# EasyEDA Pro project ProPrj_MBC1  FRAM（AM29F016）(定稿)_2024-09-28.epro, board PCB1
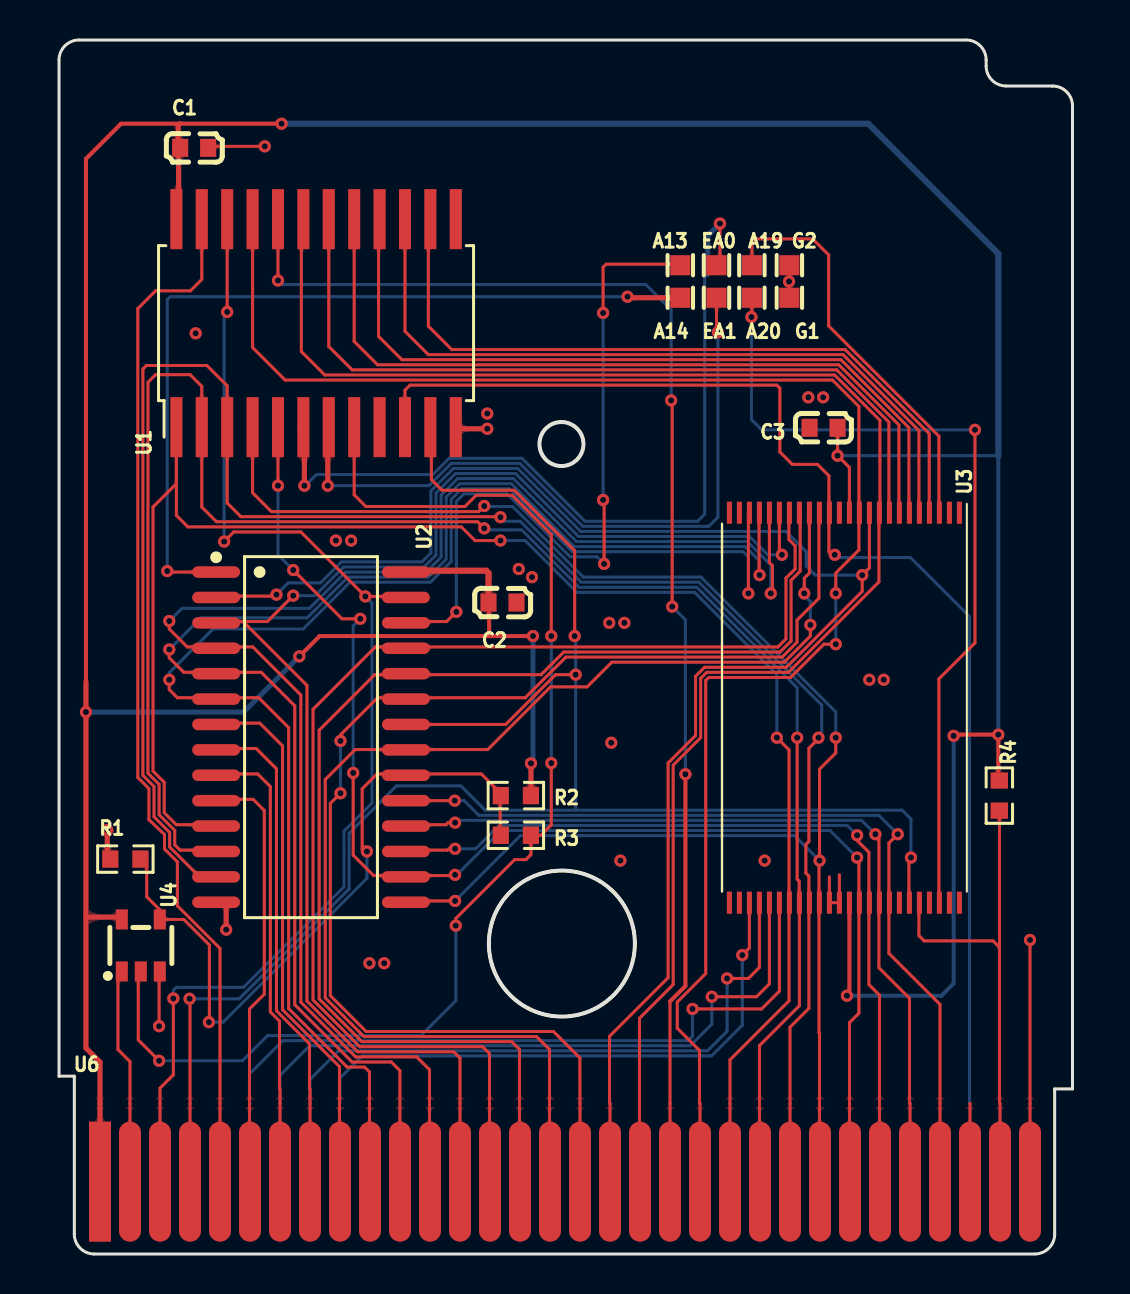
[diagram p1: board, top side]
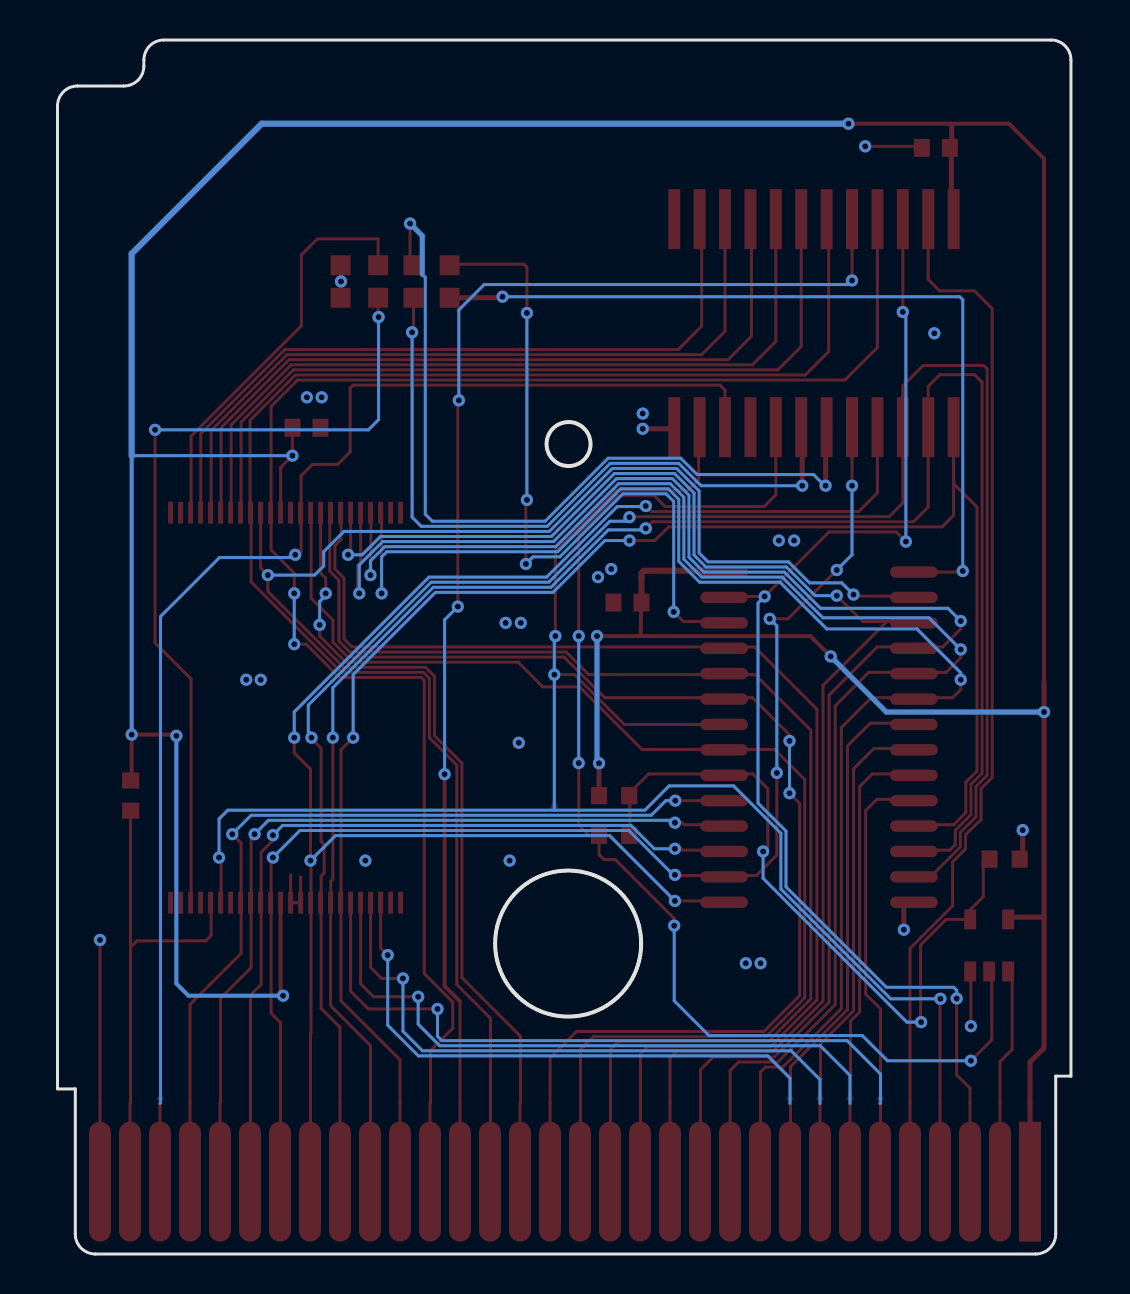
[diagram p2: board, bottom side, seen from below]

Outline 50.67 x 60.7 mm; copper layers: Top Layer, Bottom Layer. Coordinates in mm from the lower left corner of the outline.
Outline path: circle c25.12,40.5 r1.1 ; circle c25.14,15.52 r3.65 ; 0,59.7 arc(0.29,60.41) 1,60.7 45.36,60.7 arc(46.06,60.41) 46.36,59.7 46.36,59.4 arc(46.65,58.69) 47.36,58.4 49.67,58.4 arc(50.38,58.11) 50.67,57.4 50.67,8.25 49.78,8.25 49.78,1 arc(49.49,0.29) 48.78,0 1.76,0 arc(1.05,0.29) 0.76,1 0.76,8.89 0,8.89 0,59.7 ; 21.49,15.52 arc(25.14,19.17) 28.79,15.52 arc(25.14,11.87) 21.49,15.52
Stack: Top Layer 0.035mm / Dielectric1 1.51mm FR4 er 4.5 / Bottom Layer 0.035mm

## Design rules (mm)
template: JLCPCB Capability(Two Layers Board)
spacing copperThickness1oz (default): track to track 0.102, other pairs 0.152 to 0.3
spacing copperThickness2oz: track to track 0.203, other pairs 0.152 to 0.3
track width copperThickness1oz (default): min 0.127, default 0.254, max 2.54
track width copperThickness2oz: min 0.203, default 0.254, max 2.54
differential pair differentialPair (default): width min 0.127, default 0.254, max 2.54; gap min 0.152, default 0.152
via viaSize (default): diameter min 0.5, default 0.61, max 10; hole min 0.3, default 0.305, max 6.3

## Placement (name value [footprint] x y rotation side)
A13  Battery_Positive_After_Resistor  [test_1p]  31.06 49.44 0 top
A14  RTC_VOUT  [test_1p]  31.06 47.81 0 top
A19  Battery_Positive  [test_1p]  34.64 49.44 0 top
A20  Ground  [test_1p]  34.64 47.81 0 top
C1  100nF  [C0603]  6.76 55.31 180 top
C2  100nF  [C0603]  22.17 32.57 180 top
C3  100nF  [C0603]  38.23 41.31 0 top
EA0  Battery_Positive  [test_1p]  32.87 49.44 0 top
EA1  Ground  [test_1p]  32.87 47.81 0 top
G1  Ground  [test_1p]  36.52 47.81 0 top
G2  Battery_Positive  [test_1p]  36.52 49.44 0 top
R1  1kΩ  [R0603]  3.32 19.75 180 top
R2  10kΩ  [R0603]  22.84 22.92 0 top
R3  0Ω  [R0603]  22.84 20.94 0 top
R4  10kΩ  [R0603]  47.02 22.92 270 top
U1  MBC1  [MemoryBC1:SOIC-24 W_7.5x15.4mm_P1.27mm]  12.85 46.54 90 top
U2  FM1808B-SGTR  [SOIC-28_L17.9-W7.5-P1.27-LS10.3-BL]  12.6 25.84 270 top
U3  AM29F016  [Package_SO:TSOP-I-48_18.4x12mm_P0.5mm]  39.27 27.31 270 top
U4  SN74LVC1G32DBVR  [SOT-23-5_L3.0-W1.7-P0.95-LS2.8-BR]  4.09 15.43 270 top
U6  -  [gbgba cartbus]  25.3 3.62 0 top

## Footprints (pads in the part's own frame, mm; a bottom-side part is the same pattern mirrored in y, then rotated)
C0603
  rect 0.8x0.9 smd: 1(-0.7,0) 2(0.7,0)
gbgba cartbus
  rect 1.1x6 smd: 1(-23.25,0)
  oval 1.1x6 smd: 2(-21.75,0) 3(-20.25,0) 4(-18.75,0) 5(-17.25,0) 6(-15.75,0) 7(-14.25,0) 8(-12.75,0) 9(-11.25,0) 10(-9.75,0) 11(-8.25,0) 12(-6.75,0) 13(-5.25,0) 14(-3.75,0) 15(-2.25,0) 16(-0.75,0) 17(0.75,0) 18(2.25,0) 19(3.75,0) 20(5.25,0) 21(6.75,0) 22(8.25,0) 23(9.75,0) 24(11.25,0) 25(12.75,0) 26(14.25,0) 27(15.75,0) 28(17.25,0) 29(18.75,0) 30(20.25,0) 31(21.75,0) 32(23.25,0)
MemoryBC1:SOIC-24 W_7.5x15.4mm_P1.27mm
  rect 3x0.6 smd: 1(-5.2,6.985) 2(-5.2,5.715) 3(-5.2,4.445) 4(-5.2,3.175) 5(-5.2,1.905) 6(-5.2,0.635) 7(-5.2,-0.635) 8(-5.2,-1.905) 9(-5.2,-3.175) 10(-5.2,-4.445) 11(-5.2,-5.715) 12(-5.2,-6.985) 13(5.2,-6.985) 14(5.2,-5.715) 15(5.2,-4.445) 16(5.2,-3.175) 17(5.2,-1.905) 18(5.2,-0.635) 19(5.2,0.635) 20(5.2,1.905) 21(5.2,3.175) 22(5.2,4.445) 23(5.2,5.715) 24(5.2,6.985)
Package_SO:TSOP-I-48_18.4x12mm_P0.5mm
  rect 1.1x0.25 smd: 1(-9.75,5.75) 2(-9.75,5.25) 3(-9.75,4.75) 4(-9.75,4.25) 5(-9.75,3.75) 6(-9.75,3.25) 7(-9.75,2.75) 8(-9.75,2.25) 9(-9.75,1.75) 10(-9.75,1.25) 11(-9.75,0.75) 12(-9.75,0.25) 13(-9.75,-0.25) 14(-9.75,-0.75) 15(-9.75,-1.25) 16(-9.75,-1.75) 17(-9.75,-2.25) 18(-9.75,-2.75) 19(-9.75,-3.25) 20(-9.75,-3.75) 21(-9.75,-4.25) 22(-9.75,-4.75) 23(-9.75,-5.25) 24(-9.75,-5.75) 25(9.75,-5.75) 26(9.75,-5.25) 27(9.75,-4.75) 28(9.75,-4.25) 29(9.75,-3.75) 30(9.75,-3.25) 31(9.75,-2.75) 32(9.75,-2.25) 33(9.75,-1.75) 34(9.75,-1.25) 35(9.75,-0.75) 36(9.75,-0.25) 37(9.75,0.25) 38(9.75,0.75) 39(9.75,1.25) 40(9.75,1.75) 41(9.75,2.25) 42(9.75,2.75) 43(9.75,3.25) 44(9.75,3.75) 45(9.75,4.25) 46(9.75,4.75) 47(9.75,5.25) 48(9.75,5.75)
R0603
  rect 0.806x0.864 smd: 1(-0.753,0) 2(0.753,0)
SOIC-28_L17.9-W7.5-P1.27-LS10.3-BL
  oval 0.574x2.388 smd: 1(-8.255,-4.744) 2(-6.985,-4.744) 3(-5.715,-4.744) 4(-4.445,-4.744) 5(-3.175,-4.744) 6(-1.905,-4.744) 7(-0.635,-4.744) 8(0.635,-4.744) 9(1.905,-4.744) 10(3.175,-4.744) 11(4.445,-4.744) 12(5.715,-4.744) 13(6.985,-4.744) 14(8.255,-4.744) 15(8.255,4.744) 16(6.985,4.744) 17(5.715,4.744) 18(4.445,4.744) 19(3.175,4.744) 20(1.905,4.744) 21(0.635,4.744) 22(-0.635,4.744) 23(-1.905,4.744) 24(-3.175,4.744) 25(-4.445,4.744) 26(-5.715,4.744) 27(-6.985,4.744) 28(-8.255,4.744)
SOT-23-5_L3.0-W1.7-P0.95-LS2.8-BR
  rect 1x0.6 smd: 1(1.3,-0.95) 2(1.3,0) 3(1.3,0.95) 4(-1.3,0.95) 5(-1.3,-0.95)
test_1p
  rect 1x1 smd: 1(0,0)

## Nets
As in the schematic.

Pads without a net: U1 9 13; U3 1 2 13 23 24 25 26 42 45 47 48

## Via types
v1: diameter 0.61, hole 0.305, Top Layer to Bottom Layer, 106 vias

## Routing (per net, layer and track width the routed paths; a pad name or vN(x,y) marks a point on that pad's centre or on a via; arc(x,y) is an arc through that point)
5V: length 210.7
  Top Layer w0.152: U3.12 39.52,39.33 v1(38.93,39.92) C3.2
  Top Layer w0.2: 21.51,30.9 13.03,30.9 v1(12.01,29.88) ; 21.51,30.9 v1(23.7,30.9) ; 21.51,30.9 21.47,33.82 ; 46.96,23.72 v1(46.96,25.97) 44.79,25.97 v1(44.73,25.91) ; v1(11.12,56.52) 3.1,56.52 1.35,54.76 1.35,28.61 ; U3.37 39.52,13.04 v1(39.39,12.91)
  Top Layer w0.254: 1.35,28.61 v1(1.35,27.1) 1.35,16.84 ; 1.35,16.84 1.35,10.3 2.05,9.59 U6.1 ; 1.35,16.84 3.02,16.84 U4.5 ; 6.03,56.52 5.96,56.44 5.96,55.06 ; v1(23.6,24.54) 23.6,23.1 ; 5.98,55.04 5.98,52.05
  Top Layer w0.305: 17.6,34.16 21.36,34.16 21.47,34.05 C2.2
  Bottom Layer w0.152: 46.96,39.9 46.95,39.92 v1(38.93,39.92)
  Bottom Layer w0.2: v1(44.73,25.91) 44.73,13.52 44.12,12.91 v1(39.39,12.91) ; 46.96,25.96 46.96,39.9
  Bottom Layer w0.254: v1(12.01,29.88) 9.23,27.1 v1(1.35,27.1) ; v1(23.7,30.9) 23.7,24.64 v1(23.6,24.54)
  Bottom Layer w0.305: 46.96,39.9 46.96,50.01 40.46,56.52 v1(11.12,56.52)
GND: length 28.5
  Top Layer w0.152: U4.3 5,14.09 v1(5,11.39) ; v1(48.55,15.7) U6.32 ; G1.1 G2.1 ; v1(10.29,55.38) 7.53,55.38 C1.1 ; 38.52,18.86 U3.35 U3.36 39.02,18.96
  Top Layer w0.254: v1(21.41,41.26) 20.11,41.26 19.84,41.54 ; 2.56,19.75 2.41,19.9 v1(2.41,21.19) ; 7.02,17.65 8.36,17.65 v1(8.36,16.22)
  vias: v1(6.83,46.03) v1(13.84,35.67) v1(14.6,35.67) v1(15.52,14.54) v1(16.26,14.54) v1(21.41,42.02) v1(22.99,34.25) v1(23.65,33.84) v1(27.51,31.56) v1(27.61,25.56) v1(28.07,19.67) v1(28.27,31.56) v1(35.28,19.67) v1(36.5,48.63) v1(37.46,42.83) v1(38.2,42.83) v1(40.51,28.71) v1(41.24,28.71)
A0: length 56
  Top Layer w0.152: U6.6 9.52,3.64 9.52,12.25 10.26,12.99 10.26,22.17 9.7,22.73 8.3,22.73 ; v1(31.67,12.25) 35.13,12.25 36.02,13.14 U3.30
  Bottom Layer w0.152: 9.55,7.53 9.52,7.55 9.52,9 11.19,10.67 31.46,10.67 31.67,10.88 v1(31.67,12.25)
A1: length 55.1
  Top Layer w0.152: 8.3,24 9.93,24 10.57,23.37 10.57,12.1 11.02,11.65 11.02,8.27 11.05,8.24 U6.7 ; v1(32.64,12.86) 34.87,12.86 35.52,13.51 U3.29
  Bottom Layer w0.152: 11.05,7.53 11.05,8.93 12.53,10.41 31.56,10.41 32.64,11.49 v1(32.64,12.86)
A2: length 55.1
  Top Layer w0.152: U3.28 35.02,14.33 34.47,13.78 v1(33.4,13.78) ; U6.8 12.55,8.24 12.52,8.27 12.52,10.51 10.87,12.16 10.87,24.26 9.86,25.27 8.3,25.27
  Bottom Layer w0.152: 12.55,7.53 12.55,8.72 13.98,10.16 32.42,10.16 33.4,11.14 v1(33.4,13.78)
A3: length 55.1
  Top Layer w0.152: U6.9 14.02,3.64 14.02,9.37 11.18,12.21 11.18,25.4 10.04,26.54 8.3,26.54 ; v1(34.16,14.95) 34.52,15.3 U3.27
  Bottom Layer w0.152: v1(34.16,14.95) 34.16,11.44 32.63,9.91 15.16,9.91 14.05,8.79 14.05,7.53
A4: length 74.3
  Top Layer w0.152: v1(34.47,33.03) 34.47,37.01 U3.22 ; v1(5.51,28.71) 5.51,28.22 5.92,27.81 9.98,27.81 11.48,26.32 11.48,12.27 14.4,9.35 15.28,9.35 15.52,9.1 15.52,3.64 U6.10
  Bottom Layer w0.152: v1(34.47,33.03) 34.47,34.85 34.21,35.11 25.66,35.11 22.51,38.26 20.14,38.26 19.61,37.73 19.61,34.63 18.57,33.59 14.54,33.59 12.21,31.25 7.7,31.25 5.51,29.06 5.51,28.83
A5: length 75.1
  Top Layer w0.152: v1(35.03,33.94) 35,33.97 35,37.15 ; U6.11 17.04,3.62 17.04,9.17 16.61,9.6 14.65,9.6 11.79,12.47 11.79,27.41 10.11,29.08 6.24,29.08 5.51,29.81 5.51,30.23
  Bottom Layer w0.152: 5.51,30.23 7.1,31.81 12.41,31.81 14.44,33.84 18.46,33.84 19.36,34.74 19.36,37.84 20.03,38.52 22.62,38.52 25.77,35.37 34.31,35.37 35.03,34.65 v1(35.03,33.94)
  vias: v1(5.51,30.23)
A6: length 79.3
  Top Layer w0.152: U3.20 35.52,34.57 35.67,34.42 35.67,33.11 v1(35.58,33.03) ; 5.51,31.65 5.51,31.25 6.41,30.35 9.69,30.35 12.09,27.95 12.09,12.59 14.83,9.85 17.88,9.85 18.52,9.21 18.52,3.64 U6.12
  Bottom Layer w0.152: v1(35.58,33.03) 35.58,34.45 34.42,35.62 25.87,35.62 22.72,38.77 19.93,38.77 19.1,37.94 19.1,34.84 18.36,34.1 14.33,34.1 12.52,32.28 6.15,32.28 5.51,31.65
  vias: v1(5.51,31.65)
A7: length 71.3
  Top Layer w0.152: v1(36.14,34.96) 36.02,35.09 U3.19 ; v1(11.71,32.92) 10.41,31.62 9.2,31.62 ; 9.2,31.62 8.9,31.62 ; 9.2,31.62 12.39,28.43 12.39,12.65 14.93,10.11 19.74,10.11 20.05,9.8 U6.13
  Bottom Layer w0.152: v1(36.14,34.96) 35.44,34.96 34.52,35.88 25.98,35.88 22.83,39.02 19.82,39.02 18.85,38.05 18.85,34.95 18.25,34.35 14.23,34.35 12.79,32.92 v1(11.71,32.92)
A8: length 62.7
  Top Layer w0.152: U6.14 21.52,3.64 21.52,10.02 21.18,10.36 15.04,10.36 12.7,12.7 12.7,27.24 15.82,30.35 35.95,30.35 36.35,30.75 36.35,33.79 36.8,34.25 36.8,35.41 36.49,35.72 36.49,37.15
A9: length 63.3
  Top Layer w0.152: U6.15 23.02,3.64 23.02,10.23 22.63,10.62 15.14,10.62 13,12.76 13,26.19 15.78,28.97 24.1,28.97 25.24,30.1 36.05,30.1 36.6,30.65 36.6,33.69 37.06,34.14 37.06,37.09 36.99,37.15
A10: length 63.4
  Top Layer w0.152: v1(37.57,31.46) 37.57,30.9 36.26,29.59 27.64,29.59 26.41,28.36 24.57,28.36 21.44,25.22 14.81,25.22 13.31,23.72 13.31,12.81 15.25,10.87 23.88,10.87 24.52,10.22 24.52,3.64 U6.16 ; 37.26,32.93 37.26,33.79 37.52,34.05 U3.16
  Bottom Layer w0.152: 37.26,32.93 37.57,32.62 v1(37.57,31.46)
  vias: v1(37.26,33.03)
A11: length 65
  Top Layer w0.152: 37.99,37.15 37.99,32.79 36.9,31.69 36.9,30.59 36.16,29.84 25.34,29.84 23.31,27.81 15.93,27.81 14.07,25.96 v1(14.07,25.65) ; U6.17 26.06,3.62 26.05,7.53 26.04,9.81 24.72,11.12 15.35,11.12 13.56,12.92 13.56,22.53 v1(14.07,23.04)
  Bottom Layer w0.152: v1(14.07,25.65) v1(14.07,23.04)
A12: length 80.2
  Top Layer w0.152: U3.10 40.52,34.31 v1(40.16,33.94) 40.16,33.13 36.37,29.34 32.28,29.34 31.83,28.89 31.83,25.92 30.45,24.55 30.45,13.82 27.52,10.89 27.52,7.55 27.55,7.53 U6.18 ; v1(10.87,32.97) 10.8,32.89 8.3,32.89
  Bottom Layer w0.152: v1(40.16,33.94) 37.82,33.94 37.36,34.4 37.36,35.11 36.35,36.13 26.08,36.13 22.93,39.28 19.72,39.28 18.59,38.15 18.59,35.05 18.15,34.61 14.12,34.61 13.07,33.56 11.46,33.56 v1(10.87,32.97)
A13: length 82.5
  Top Layer w0.152: U1.19 12.12,51.64 12.12,45.12 13.28,43.95 38.78,43.95 41.04,41.69 41.04,37.08 40.99,37.03 ; 40.99,37.03 40.99,33.6 36.47,29.08 32.38,29.08 32.08,28.78 32.08,25.82 30.71,24.45 30.71,13.47 29.02,11.79 29.02,3.64 U6.19
A14: length 67.4
  Top Layer w0.152: v1(30.66,32.37) 30.66,42.53 30.61,42.58 ; U6.20 30.55,12.63 ; U1.20 v1(10.95,48.68)
  Top Layer w0.2: v1(31.32,23.99) 31.32,13.4 30.55,12.63
  Bottom Layer w0.152: v1(30.66,32.37) 31.32,31.71 v1(31.32,23.99) ; v1(10.95,48.68) 11.15,48.47 29.34,48.47 30.61,47.2 v1(30.61,42.68)
A15: length 83.9
  Top Layer w0.152: v1(38.84,30.49) 38.24,30.49 36.58,28.83 32.49,28.83 32.33,28.68 32.33,14.02 30.91,12.6 30.91,11.29 32.02,10.18 32.02,7.55 32.05,7.53 U6.21 ; 9.68,51.94 9.68,45.32 11.3,43.7 38.67,43.7 39.99,42.38 39.99,35.2 38.84,34.05 v1(38.84,33.03)
  Bottom Layer w0.152: v1(38.84,30.49) v1(38.84,33.03)
A16: length 38.6
  Top Layer w0.152: 42.49,37.02 42.49,41.31 39.09,44.71 17.14,44.71 15.98,45.88 15.98,51.69 U1.16
A17: length 37.5
  Top Layer w0.152: 42.99,37.03 42.99,41.17 39.2,44.97 18.47,44.97 17.3,46.14 U1.15
A18: length 36.5
  Top Layer w0.152: U1.14 18.47,51.64 18.47,46.39 19.63,45.22 39.3,45.22 43.51,41.02 43.51,37.22
AU: length 24.6
  Top Layer w0.152: 47.02,15.34 47.02,7.55 47.05,7.53 U6.31 ; 47.02,15.34 47.02,22.15 ; 47.02,15.34 46.7,15.66 43.26,15.66 42.99,15.92 42.99,17.71
CE: length 35.6
  Top Layer w0.152: v1(15.39,20.13) 15.27,20.13 15.16,20.23 15.16,23.26 15.9,24 21.12,24 22.06,23.06 22.06,20.7 ; v1(7.49,11.59) 7.52,11.62 7.52,15.45 6.24,16.73 U4.4 5.04,17.21 4.38,17.86 4.38,19.69
  Bottom Layer w0.152: v1(7.49,11.59) 8.2,11.59 15.39,18.78 v1(15.39,20.13)
CLK: length 10.6
  Top Layer w0.152: 3.14,13.87 2.95,13.68 2.95,10.22 3.55,9.62 U6.2
CS: length 52.4
  Top Layer w0.152: 7.14,51.94 7.14,48.73 6.57,48.16 4.83,48.16 3.94,47.27 3.94,23.83 4.5,23.27 4.5,21.72 5.27,20.97 5.27,20.25 5.92,19.61 5.92,17.41 8.05,15.28 U6.5
D0: length 86.2
  Top Layer w0.152: 5.87,38.62 5.87,36.93 6.44,36.36 20.12,36.36 20.8,35.67 v1(22.07,35.67) ; 5.87,38.62 5.87,39.66 ; 5.87,38.62 5.87,38.52 4.7,37.35 4.7,24.14 5.26,23.59 5.26,22.07 5.86,21.46 8.3,21.46 ; 5.87,38.62 5.87,39.66 ; v1(35.89,25.82) 36.5,25.21 36.5,12.66 33.55,9.71 U6.22 ; 5.87,39.66 U1.1
  Bottom Layer w0.152: v1(35.89,25.82) 35.89,28.97 31.78,33.08 25.9,33.08 23.31,35.67 v1(22.07,35.67)
D1: length 94.5
  Top Layer w0.152: U6.23 35.02,3.64 35.02,10.42 37.02,12.42 U3.32 37.01,17.58 37.01,18.64 36.91,18.74 v1(36.91,25.82) ; 8.3,20.19 6.05,20.19 5.78,20.46 5.78,21.18 5,21.96 5,23.48 4.45,24.04 4.44,43.59 4.83,43.97 6.55,43.97 7.14,43.38 U1.2 7.14,37.35 7.87,36.61 20.93,36.61 v1(21.26,36.28)
  Bottom Layer w0.152: v1(21.26,36.28) 21.34,36.2 23.13,36.2 26,33.34 31.88,33.34 36.91,28.31 v1(36.91,25.82)
D2: length 96.8
  Top Layer w0.152: U6.24 36.55,11.34 37.49,12.28 37.49,18.89 37.34,19.05 37.34,20.47 37.49,20.63 37.49,25.29 37.97,25.77 ; v1(22.07,36.84) 22.05,36.87 9.09,36.87 8.41,37.55 U1.3 8.41,43.41 7.39,44.42 4.37,44.42 4.19,44.25 4.19,23.93 4.75,23.37 4.75,21.86 5.53,21.08 5.53,20.35 6.96,18.92 8.3,18.92
  Bottom Layer w0.152: v1(22.07,36.84) 22.28,36.64 23.06,36.64 26.11,33.59 31.99,33.59 38.13,27.45 38.13,25.77
  vias: v1(37.97,25.82)
D3: length 83.5
  Top Layer w0.152: 17.6,17.65 v1(19.8,17.65) ; v1(21.26,37.4) 20.98,37.12 10.62,37.12 9.68,38.06 9.68,41.54 ; U6.25 38.02,3.64 38.02,11.03 38,11.06 38,19.64 v1(38.02,19.67) 38.02,24.24 38.84,25.05 38.84,25.77
  Bottom Layer w0.152: v1(21.26,37.4) 21.28,37.37 22.68,37.37 26.21,33.84 32.09,33.84 38.84,27.1 v1(38.84,25.82) ; v1(38.02,19.67) 36.77,20.92 23.07,20.92 v1(19.8,17.65)
D4: length 67.5
  Top Layer w0.152: v1(15.06,31.76) 14.15,31.76 v1(11.71,34.2) ; v1(10.95,38.42) 10.95,41.54 ; U6.26 39.52,3.64 39.52,11.57 39.99,12.04 39.99,19.73 v1(39.9,19.82) ; 19.8,18.92 15.73,18.92 14.71,19.94 v1(14.71,24.05)
  Bottom Layer w0.152: v1(10.95,38.42) 10.95,34.96 v1(11.71,34.2) ; v1(14.71,24.05) 14.71,31.41 v1(15.06,31.76) ; v1(39.9,19.82) 38.55,21.17 22.1,21.17 19.85,18.92
  vias: v1(19.8,18.96)
D5: length 40.8
  Top Layer w0.152: v1(19.8,20.26) 19.49,20.26 19.42,20.19 17.6,20.19 ; U6.27 41.02,3.64 41.02,12.94 40.49,13.47 40.49,20.09 39.9,20.68 v1(39.9,20.94)
  Bottom Layer w0.152: v1(39.9,20.94) 39.41,21.43 22,21.43 20.83,20.26 v1(19.8,20.26)
D6: length 41.7
  Top Layer w0.152: v1(19.8,21.57) 19.45,21.57 19.34,21.46 17.6,21.46 ; v1(40.82,20.99) 40.99,20.81 40.99,14.31 42.52,12.78 42.52,7.55 42.55,7.53 U6.28
  Bottom Layer w0.152: v1(40.82,20.99) 40.13,21.68 19.92,21.68 v1(19.8,21.57)
D7: length 43.9
  Top Layer w0.152: U6.29 44.05,12.48 41.49,15.03 41.49,20.55 v1(41.93,20.99) ; v1(19.79,22.67) U2.19
  Bottom Layer w0.152: v1(41.93,20.99) 40.99,21.94 20.99,21.94 20.26,22.67 v1(19.79,22.67)
EA0: length 42.1
  Top Layer w0.152: EA0.1 33.05,49.61 v1(33.05,51.52)
  Top Layer w0.254: 12.06,41.38 12.27,41.18 v1(12.27,38.42)
  Bottom Layer w0.152: 32.44,48.98 32.28,48.83 32.28,36.99 31.93,36.64 26.29,36.64 23.14,39.79 19.51,39.79 18.7,38.97 12.87,38.97 12.31,38.42 v1(12.27,38.42)
  Bottom Layer w0.254: 32.44,48.98 32.44,50.91 v1(33.05,51.52)
EA1: length 35.7
  Top Layer w0.152: v1(32.94,46.09) 32.87,46.16 EA1.1
  Top Layer w0.254: v1(13.44,38.42) 13.44,41.59 13.49,41.54
  Bottom Layer w0.152: v1(13.44,38.42) 18.49,38.42 19.61,39.53 23.04,39.53 26.19,36.38 32.49,36.38 32.94,36.84 v1(32.94,46.09)
O1: length 42.3
  Top Layer w0.152: 8.37,34.1 5.46,34.1 v1(5.41,34.15)
  Top Layer w0.254: v1(28.42,47.86) 28.52,47.86 28.57,47.81 A14.1
  Bottom Layer w0.152: v1(5.41,34.15) 5.41,47.71 5.56,47.86 v1(28.42,47.86)
O2: length 35.8
  Top Layer w0.152: 17.6,31.62 19.38,31.62 v1(19.86,32.11) ; 31.01,49.49 27.35,49.49 27.2,49.34 v1(27.2,47.05) ; v1(27.2,37.7) 27.25,37.65 v1(27.25,34.5)
  Top Layer w0.254: 31.01,49.49 A13.1
  Bottom Layer w0.152: v1(19.86,32.11) 19.86,37.63 20.24,38.01 22.41,38.01 25.56,34.86 26.9,34.86 v1(27.25,34.5) ; v1(27.2,47.05) v1(27.2,37.7)
O3: length 20.7
  Top Layer w0.152: 43.99,37.03 43.99,40.89 38.48,46.4 38.48,49.95 37.68,50.75 34.64,50.75 A19.1
O4: length 41.9
  Top Layer w0.152: v1(34.62,46.85) 34.64,46.87 A20.1 ; v1(45.8,41.21) 45.8,30.56 43.99,28.75 43.99,17.59
  Bottom Layer w0.152: v1(45.8,41.21) 35.13,41.21 34.62,41.72 v1(34.62,46.85)
RA14: length 40.5
  Top Layer w0.152: 41.49,37.03 41.49,41.6 38.88,44.21 14.66,44.21 13.49,45.37 U1.18
RA15: length 39.5
  Top Layer w0.152: U1.17 14.76,45.63 15.93,44.46 38.99,44.46 41.99,41.45 41.99,37.03
RAMCS: length 61.6
  Top Layer w0.152: 19.84,16.25 19.84,16.77 22.78,19.72 23.34,19.72 23.59,19.97 R3.2 24.09,20.94 24.61,21.45 v1(24.61,24.55) ; v1(24.61,30.9) 24.61,35.97 22.65,37.93 20.85,37.93 20.29,37.37 15.34,37.37 14.76,37.96 U1.8 ; v1(5,9.66) 3.96,10.7 3.96,14 U4.2
  Bottom Layer w0.152: v1(24.61,30.9) v1(24.61,24.55) ; v1(5,9.66) 9.17,9.66 10.43,10.92 18.1,10.92 19.84,12.66 v1(19.84,16.42)
RD: length 89.9
  Top Layer w0.152: U2.22 22.33,26.48 24.82,28.97 v1(25.83,28.97) ; U6.4 6.55,12.73 6.5,12.78 ; v1(42.6,19.82) 42.49,19.72 42.49,17.71 ; v1(25.78,30.9) 25.78,35.16 22.76,38.19 19.15,38.19 18.62,38.72 18.62,41.29 U1.11
  Bottom Layer w0.152: v1(42.6,19.82) 42.6,21.75 42.16,22.19 25.78,22.19 ; 25.78,22.19 25.83,22.24 v1(25.83,28.97) 25.83,30.85 v1(25.78,30.9) ; 25.78,22.19 21.3,22.19 20.09,23.4 16.87,23.4 14.5,21.04 14.5,18.25 9.01,12.76 v1(6.53,12.76)
RST: length 67.1
  Top Layer w0.152: 17.3,41.54 17.3,43.19 17.55,43.44 35.89,43.44 36.04,43.29 36.04,40.1 36.66,39.48 37.92,39.48 38.49,38.91 38.49,35.12 38.79,34.82 ; 45.55,7.53 U6.30
  Bottom Layer w0.152: 45.55,7.53 45.52,7.55 45.52,31.87 42.57,34.82 38.79,34.82
  vias: v1(38.79,34.96)
WR: length 62.8
  Top Layer w0.152: v1(5.71,12.78) 5.71,8.96 5.05,8.29 U6.3 ; v1(8.41,47.1) 8.41,51.94 ; 17.6,32.89 17.59,32.88 v1(15.32,32.88) 12.09,36.1 8.74,36.1 v1(8.25,35.62)
  Bottom Layer w0.152: 5.71,12.98 5.71,13.18 5.87,13.34 9.23,13.34 14.25,18.36 14.25,21.15 15.65,22.54 15.65,32.55 v1(15.32,32.88) ; v1(8.25,35.62) 8.25,46.95 v1(8.41,47.1)

## Copper pours and planes (outline as drawn; the poured copper is in the pictures)
GND on Top Layer: -3.89,63.71 52.96,63.71 52.96,8.09 -3.89,8.09
GND on Bottom Layer: -2.82,62.29 53.06,62.29 53.06,7.99 -2.82,7.99

Small or netless copper shapes (teardrops, artwork), in the pictures only: 390 on Top Layer, 89 on Bottom Layer

## Text on the board
Top Solder Mask Layer: 1+2 4Mb rom/256k ram / 2+3 16Mb rom/64k ram | MBC1  @Nintendo
